# Altium schematic sheet Total.SchDoc
size A3; Author: Van Hieu; Organization: BACH-KHOA-DK; Gmail: maivanhieu24042003@gmail.com
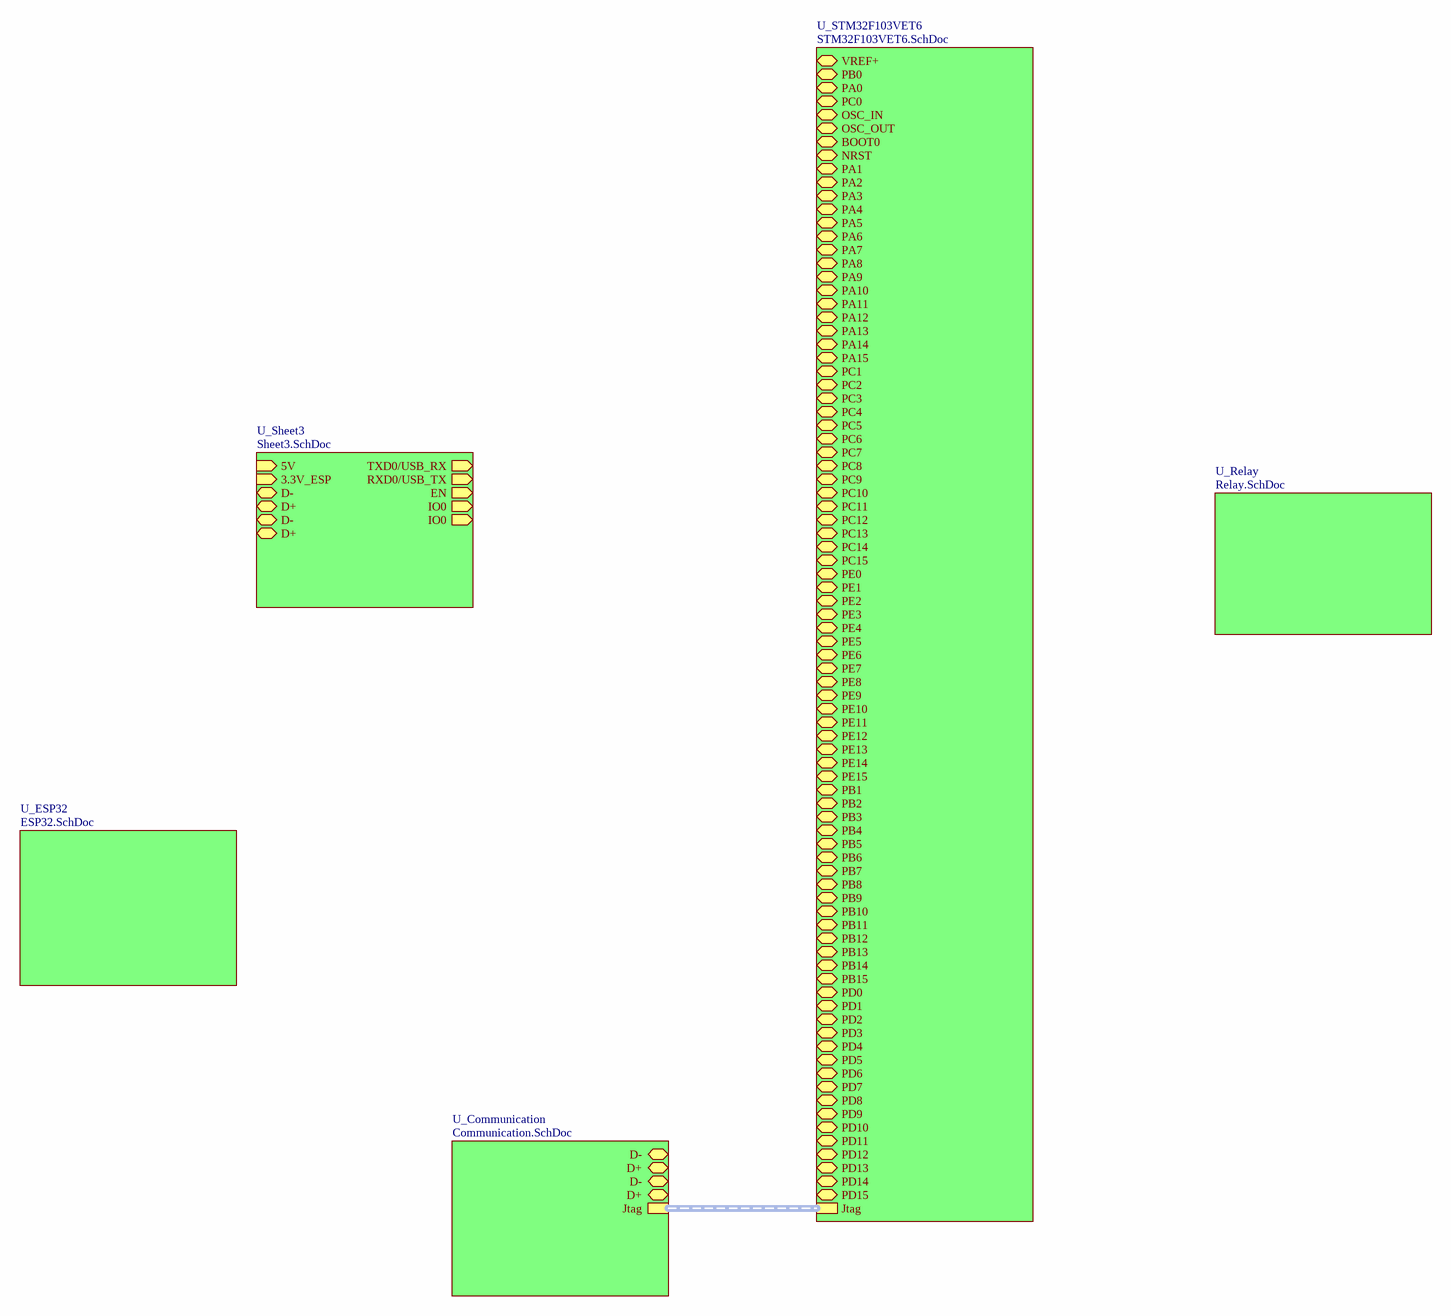
[diagram p0: Total.SchDoc]

## Sub-sheets
U_Communication = Communication.SchDoc: D- (bidir), D+ (bidir), D- (bidir), D+ (bidir), Jtag (harness *)
U_ESP32 = ESP32.SchDoc: no entries
U_Relay = Relay.SchDoc: no entries
U_Sheet3 = Sheet3.SchDoc: TXD0/USB_RX (out), RXD0/USB_TX (out), EN (out), IO0 (out), IO0 (out), 5V (in), 3.3V_ESP (in), D- (bidir), D+ (bidir), D- (bidir), D+ (bidir)
U_STM32F103VET6 = STM32F103VET6.SchDoc: VREF+ (bidir), PB0 (bidir), PA0 (bidir), PC0 (bidir), OSC_IN (bidir), OSC_OUT (bidir), BOOT0 (bidir), NRST (bidir), PA1 (bidir), PA2 (bidir), PA3 (bidir), PA4 (bidir), PA5 (bidir), PA6 (bidir), PA7 (bidir), PA8 (bidir), PA9 (bidir), PA10 (bidir), PA11 (bidir), PA12 (bidir), PA13 (bidir), PA14 (bidir), PA15 (bidir), PC1 (bidir), PC2 (bidir), PC3 (bidir), PC4 (bidir), PC5 (bidir), PC6 (bidir), PC7 (bidir), PC8 (bidir), PC9 (bidir), PC10 (bidir), PC11 (bidir), PC12 (bidir), PC13 (bidir), PC14 (bidir), PC15 (bidir), PE0 (bidir), PE1 (bidir), PE2 (bidir), PE3 (bidir), PE4 (bidir), PE5 (bidir), PE6 (bidir), PE7 (bidir), PE8 (bidir), PE9 (bidir), PE10 (bidir), PE11 (bidir), PE12 (bidir), PE13 (bidir), PE14 (bidir), PE15 (bidir), PB1 (bidir), PB2 (bidir), PB3 (bidir), PB4 (bidir), PB5 (bidir), PB6 (bidir), PB7 (bidir), PB8 (bidir), PB9 (bidir), PB10 (bidir), PB11 (bidir), PB12 (bidir), PB13 (bidir), PB14 (bidir), PB15 (bidir), PD0 (bidir), PD1 (bidir), PD2 (bidir), PD3 (bidir), PD4 (bidir), PD5 (bidir), PD6 (bidir), PD7 (bidir), PD8 (bidir), PD9 (bidir), PD10 (bidir), PD11 (bidir), PD12 (bidir), PD13 (bidir), PD14 (bidir), PD15 (bidir), Jtag (harness *)

## Buses and harness runs
harness sheet U_Communication/Jtag = sheet U_STM32F103VET6/Jtag

## Notes on the sheet
- Van Hieu
- Date:
- Size:
- A3
- Number:
- Time:
- Sheet
- Revision:
- of
- BK-DN
- File:
- maivanhieu24042003@gmail.com